# Altium schematic sheet main.SchDoc: PIC-On-The-Go
size A4; Date: 5/12/15; DrawnBy: Jarrett Rainier; Revision: 0.2; SheetNumber: 1; SheetTotal: 2
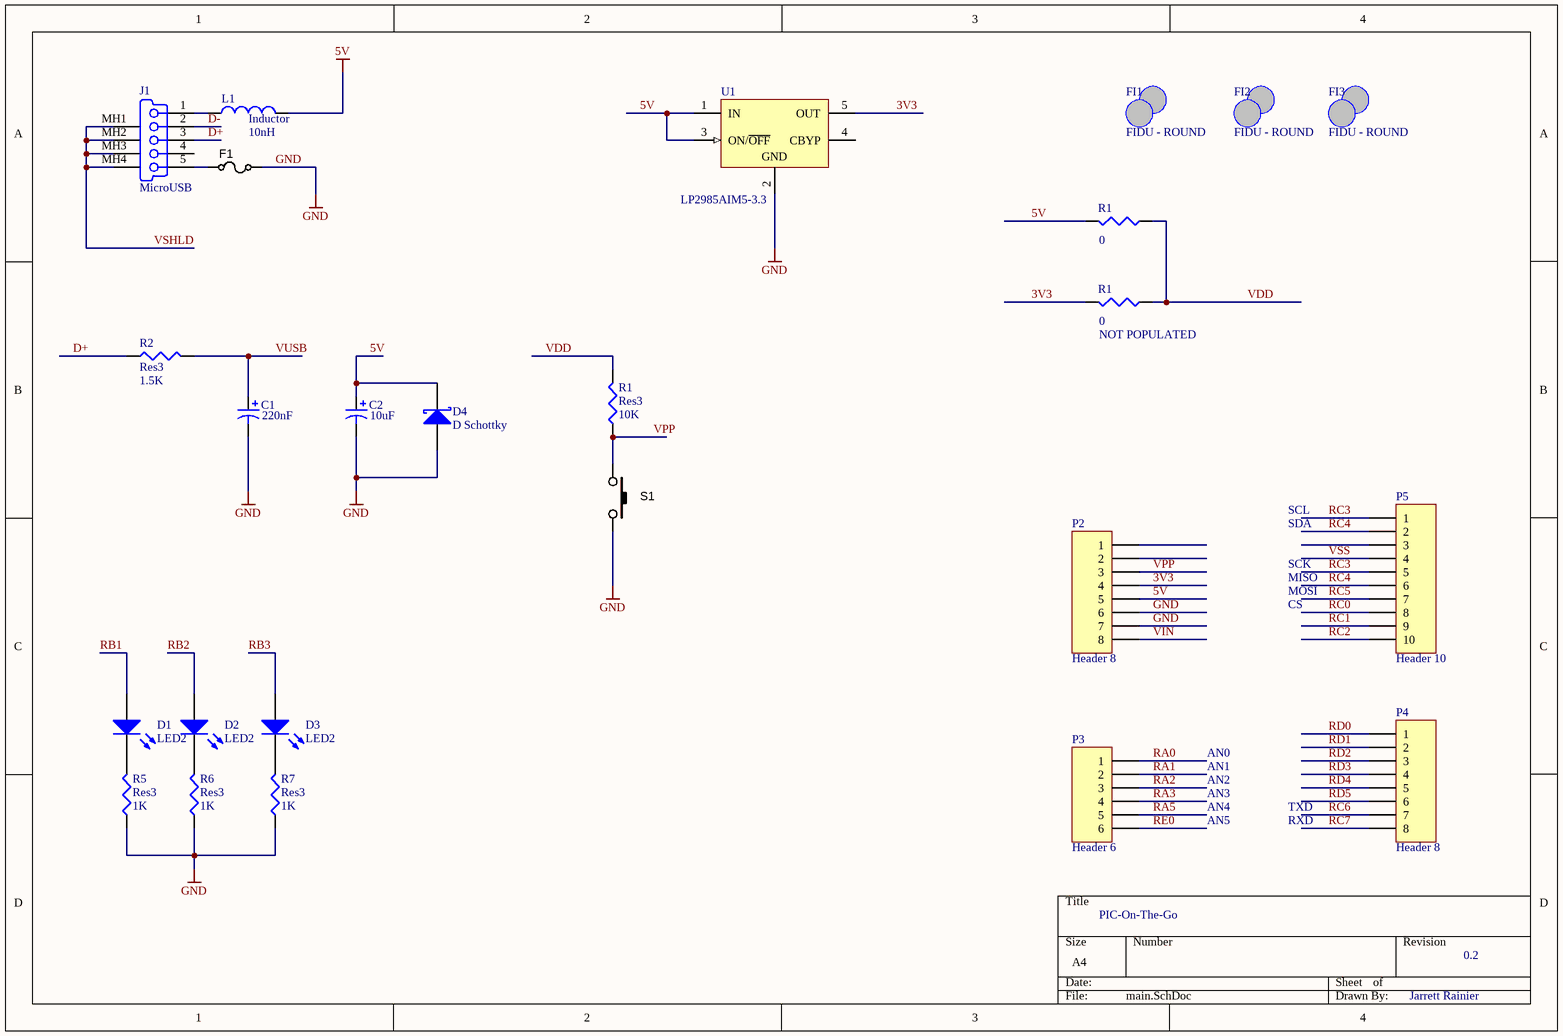
[diagram p0: main.SchDoc]

## Parts
(Parts that share a designator on the sheet are numbered #1, #2 ... from top to bottom, then left to right.)
C1  value 220nF  [C0805]  (hidden comment: Cap Pol3)
C2  value 10uF  [C0805]  (hidden comment: Cap Pol3)
D1  LED2  [3.2X1.6X1.1]
D2  LED2  [3.2X1.6X1.1]
D3  LED2  [3.2X1.6X1.1]
D4  D Schottky  [SMB]
F1  Slow-blow  [RESC3216X70N]  (value not drawn)
FI1  FIDU - ROUND  [FIDU-ROUND]
FI2  FIDU - ROUND  [FIDU-ROUND]
FI3  FIDU - ROUND  [FIDU-ROUND]
J1  MicroUSB  [microusb]
L1  Inductor  value 10nH  [0402-A]
P2  Header 8  [HDR1X8]
P3  Header 6  [HDR1X6]
P4  Header 8  [HDR1X8]
P5  Header 10  [HDR1X10]
R1#1  value 0  [J1-0603]  (hidden comment: Res3)
R1#2  NOT POPULATED  value 0  [J1-0603]
R1#3  Res3  value 10K  [J1-0603]
R2  Res3  value 1.5K  [J1-0603]
R5  Res3  value 1K  [J1-0603]
R6  Res3  value 1K  [J1-0603]
R7  Res3  value 1K  [J1-0603]
S1  TS-1143S-WP  [TS-1143S]  (value not drawn)
U1  LP2985AIM5-3.3  [MF05A_N]

## Nets
5V: C2.1 D4.2(K) L1.2 P2.5 R1#1.2 U1.1(IN) U1.3(ON/~{OFF})
GND: C1.2 C2.2 D4.1(A) F1.2 P2.6 P2.7 R5.1 R6.1 R7.1 S1.2 U1.2(GND)
3V3: P2.4 R1#2.2 U1.5(OUT)
D+: J1.3(D+) R2.1
D-: J1.2(D-)
RA0: P3.1
RA1: P3.2
RA2: P3.3
RA3: P3.4
RA5: P3.5
RB1: D1.1(A)
RB2: D2.1(A)
RB3: D3.1(A)
RC0: P5.8
RC1: P5.9
RC2: P5.10
RC3: P5.1 P5.5
RC4: P5.2 P5.6
RC5: P5.7
RC6: P4.7
RC7: P4.8
RD0: P4.1
RD1: P4.2
RD2: P4.3
RD3: P4.4
RD4: P4.5
RD5: P4.6
RE0: P3.6
VDD: R1#1.1 R1#2.1 R1#3.2
VIN: P2.8
VPP: P2.3 R1#3.1 S1.1
VSHLD: J1.MH1(Tab) J1.MH2(Tab) J1.MH3(Tab) J1.MH4(Tab)
VSS: P5.4
VUSB: C1.1 R2.2
NetD1_2: D1.2(K) R5.2
NetD2_2: D2.2(K) R6.2
NetD3_2: D3.2(K) R7.2
NetF1_1: F1.1 J1.5(GND)
NetJ1_1: J1.1(V_BUS_(5V)) L1.1

Not connected (* = marked no-connect by the designer): J1 4(NC); P2 1 2; P5 3; U1 4(CBYP)

## Notes on the sheet
- SCL
- SDA
- SCK
- MISO
- MOSI
- CS
- AN0
- AN1
- AN2
- AN3
- AN4
- AN5
- TXD
- RXD

## Library data of the parts
C1 C2 = Cap Pol3: Polarized Capacitor (Surface Mount); Published: 8-Jun-2000; LatestRevisionDate: 29-May-2009; LatestRevisionNote: IPC-7351 Footprint Added.; PackageReference: C0805; Publisher: Altium Limited; PackageDescription: Chip Capacitor
D1-D3 = LED2: Typical RED, GREEN, YELLOW, AMBER GaAs LED; Published: 8-Jun-2000; LatestRevisionDate: 17-Jul-2002; LatestRevisionNote: Re-released for DXP Platform.; PackageVersion: Feb-2002; PackageReference: 3.2X1.6X1.1; Publisher: Altium Limited; PackageDescription: SM LED; 2 Flat Leads
D4 = D Schottky: Schottky Diode; Published: 8-Jun-2000; LatestRevisionDate: 17-Jul-2002; LatestRevisionNote: Re-released for DXP Platform.; PackageReference: SMB; Publisher: Altium Limited; PackageDescription: DO-214-AA/SMB; 2 C-Bend Leads; Body 5.3 x 3.6 mm, inc. leads (LxW); Code_JEDEC: DO-214-AA
F1 = FUSE_160mA_1206: Fuse 750mA 6VDC 1206 SMD; Manufacturer 1: TE Connectivity; Manufacturer Part Number 1: NANOSMDC075F-2; Ratings: 750mA; 6VDC; slow-blow; SCDType: spec; Package / Case: 1206 (3216 metric); Value: 750mA
J1 = MicroUSB: USB On-The-Go (OTG) Mini-B Receptacle, Right Angle, SMT, 0.80mm (.031") Pitch, Solder Tabs with Back Cover, Recessed Type; PCB_Layout: Complies with Manufacturer's Recommendation.; Published: 21-Sep-2007; DatasheetVersion: revA, May-2004; PackageVersion: May-2004; PackageReference: 481900001; Publisher: Altium Limited; PackageDescription: USB Mini-B, Sinking Type, SM; 5 Position; Right Angle, Body 11.45 x 11.8 x 3.9 mm (LxWxH); ComponentLink1Description: Manufacturer Link; ComponentLink1URL: http://www.molex.com/; ComponentLink2Description: Datasheet; ComponentLink2URL: http://www.molex.com/cmc_upload/0/000/895/958/SD-48190-001RevA.pdf
L1 = Inductor: Code_IEC: 1005; Published: 8-Jun-2000; LatestRevisionDate: 29-May-2009; LatestRevisionNote: IPC-7351 Footprint Added.; PackageReference: 0402-A; Publisher: Altium Limited; PackageDescription: Chip Inductor; Code_JEITA: 0402
P2 P4 = Header 8: Header, 8-Pin; LatestRevisionDate: 17-Jul-2002; LatestRevisionNote: Re-released for DXP Platform.; Publisher: Altium Limited
P3 = Header 6: Header, 6-Pin; LatestRevisionDate: 17-Jul-2002; LatestRevisionNote: Re-released for DXP Platform.; Publisher: Altium Limited
P5 = Header 10: Header, 10-Pin; LatestRevisionDate: 17-Jul-2002; LatestRevisionNote: Re-released for DXP Platform.; Publisher: Altium Limited
R1#1-R1#3 R2 R5-R7 = Res3: Resistor; Published: 8-Jun-2000; LatestRevisionDate: 29-May-2009; LatestRevisionNote: IPC-7351 Footprint Added.; PackageReference: J1-0603; Publisher: Altium Limited; PackageDescription: Chip Resistor
S1 = SW_SMD_PB_4.3mm: Switch SMD Tact 4.3mm Stem; Manufacturer 1: Bond-Tact; Manufacturer Part Number 1: TS-1143S-WP-200; SCDType: spec; Function: On/Off; Package / Case: 6.5x6.5mm; 4.3mm stem; Supplier Part Number 1: CKN10304CT-ND; Supplier 1: Digi-Key
U1 = LP2985AIM5-3.3: Micropower 150 mA Low-Noise Ultra Low-Dropout Regulator, 5-pin SOT-23; Manufacturer: National Semiconductor; PackageTopMarking: L0RA*XTT; PowerWise: N; CompType: LDO IC; Published: 4-Dec-2008; DatasheetVersion: Jul-2007; PackageVersion: revD, Aug-2008; PackageReference: MF05A; Publisher: Altium Limited; PackageDescription: Molded SOT-23, .115 x .063 x .040 in Body, 5 Lead, .0375 in Pitch; Supplier 1: Farnell; Supplier Part Number 1: 9778276; Supplier 2: Farnell; Supplier Part Number 2: 9778276RL; PartNumber: LP2985AIM5-3.3; RoHS: N; PinCount: 5; ComponentLink1Description: LP2985 Datasheet; ComponentLink1URL: http://www.national.com/ds/LP/LP2985.pdf; ComponentLink2Description: LP2985 Web Page; ComponentLink2URL: http://www.national.com/pf/LP/LP2985.html; ComponentLink3Description: MF05A Package Page; ComponentLink3URL: http://www.national.com/packaging/folders/mf05a.html